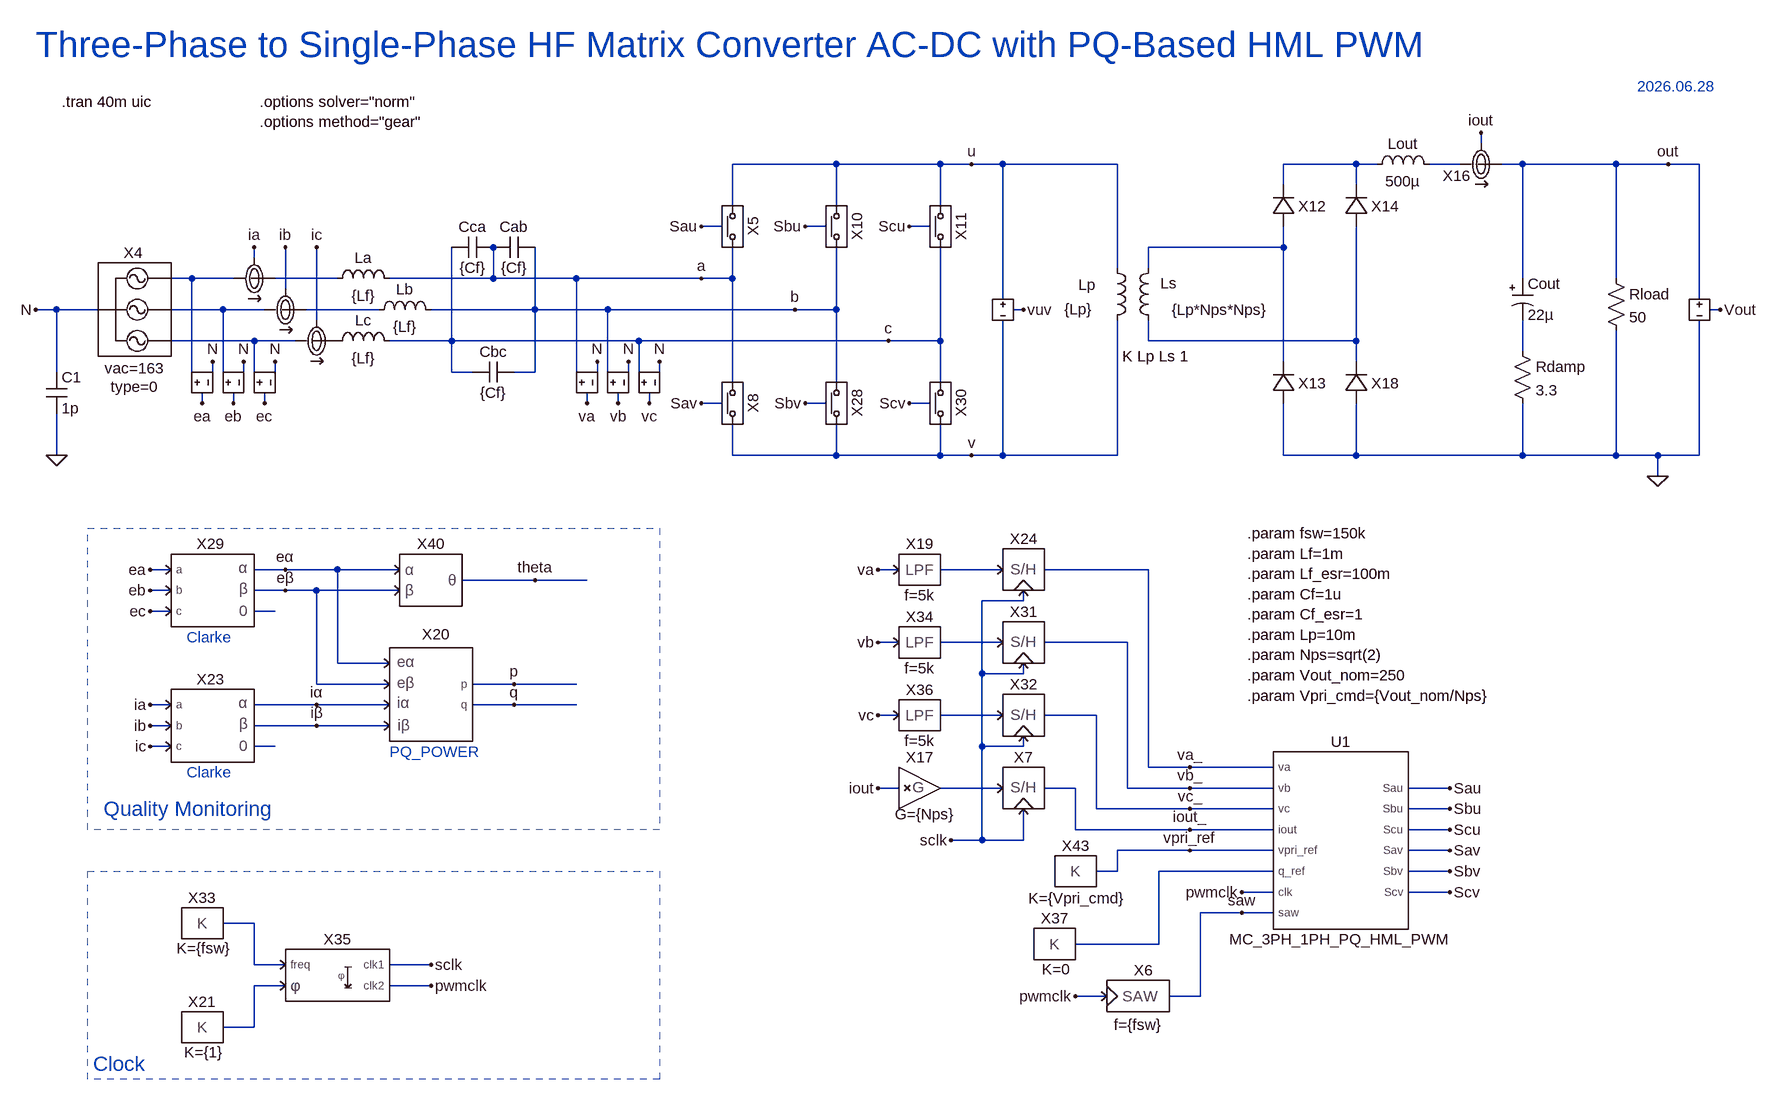
[diagram p0: schematic 3Ph-1Ph-HF-MC-ACDC.asc]
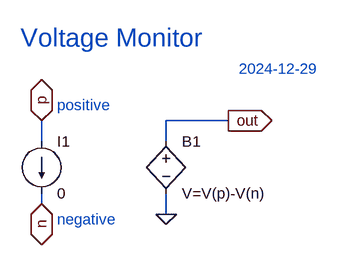
[diagram p1: sub-circuit vmon.asc]
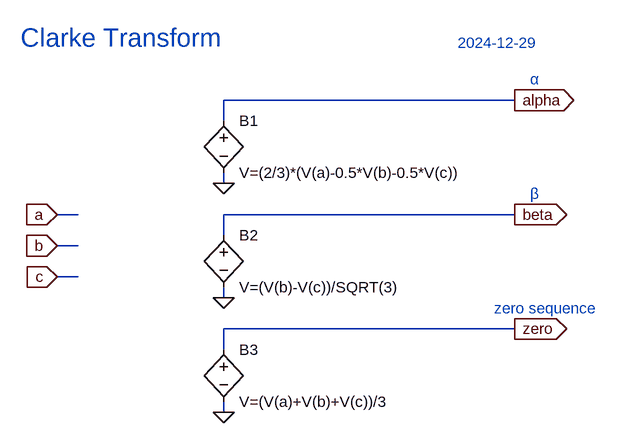
[diagram p2: sub-circuit clarke.asc]
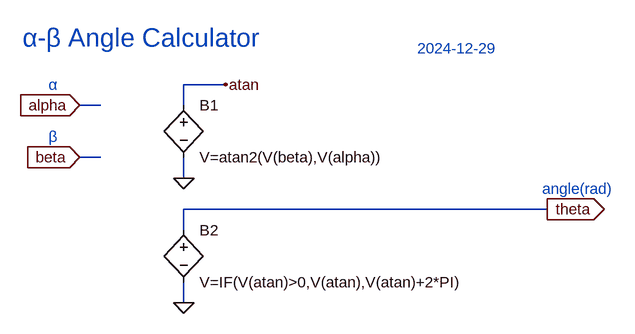
[diagram p3: sub-circuit angle.asc]
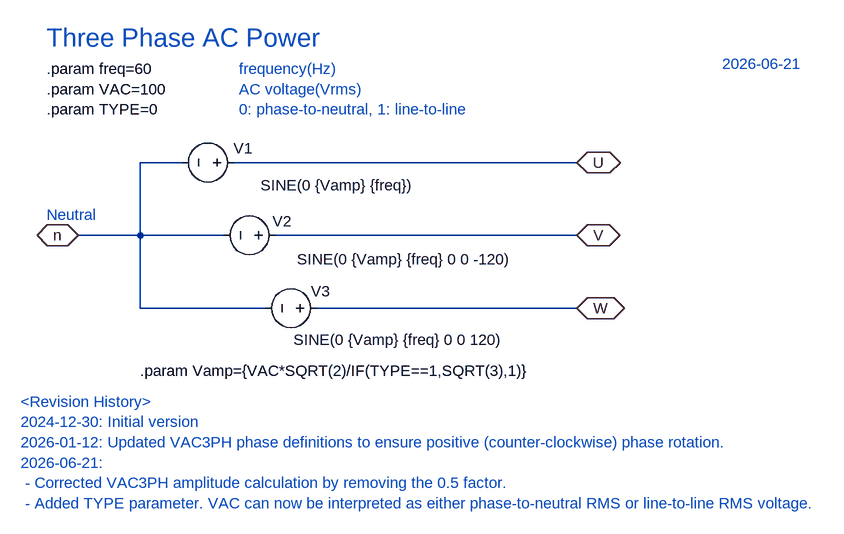
[diagram p4: sub-circuit vac3ph.asc]
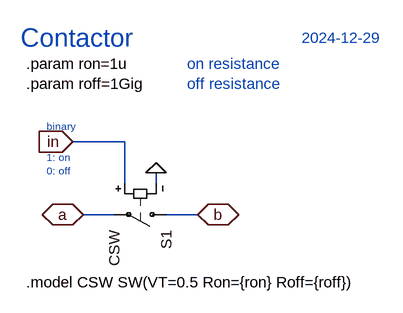
[diagram p5: sub-circuit contactor.asc]
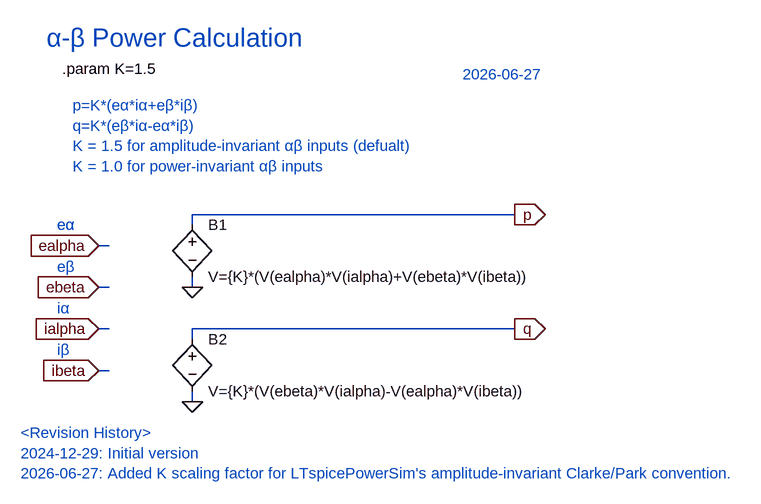
[diagram p6: sub-circuit pq_power.asc]
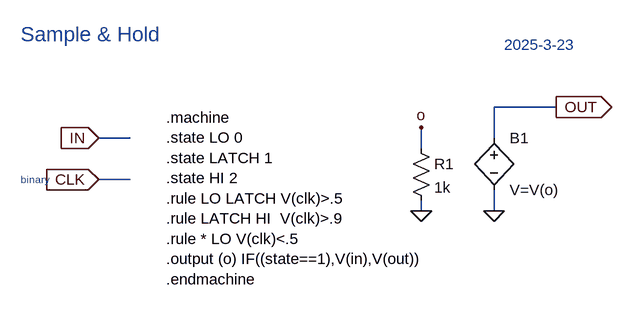
[diagram p7: sub-circuit samplehold.asc]
3Ph-1Ph-HF-MC-ACDC.asc, the LTspice schematic file:
Version 4.1
SHEET 1 2416 2284
WIRE 1360 -240 1360 -256
WIRE 368 -208 208 -208
WIRE 528 -208 368 -208
WIRE 576 -208 528 -208
WIRE 624 -208 576 -208
WIRE 800 -208 624 -208
WIRE 1168 -208 1056 -208
WIRE 1200 -208 1168 -208
WIRE 1328 -208 1280 -208
WIRE 1424 -208 1392 -208
WIRE 1568 -208 1424 -208
WIRE 1648 -208 1568 -208
WIRE 1696 -208 1648 -208
WIRE 1056 -176 1056 -208
WIRE 1168 -176 1168 -208
WIRE 208 -144 208 -208
WIRE 368 -144 368 -208
WIRE 528 -144 528 -208
WIRE 192 -112 160 -112
WIRE 352 -112 320 -112
WIRE 512 -112 480 -112
WIRE 1056 -80 1056 -112
WIRE 1056 -80 848 -80
WIRE -528 -64 -528 -80
WIRE 800 -48 800 -208
WIRE 848 -48 848 -80
WIRE -624 -32 -656 -32
WIRE -560 -32 -624 -32
WIRE -400 -32 -496 -32
WIRE -160 -32 -160 -80
WIRE -160 -32 -320 -32
WIRE -32 -32 -160 -32
WIRE 160 -32 -32 -32
WIRE 208 -32 208 -80
WIRE 208 -32 160 -32
WIRE 1424 -32 1424 -208
WIRE 1568 -32 1568 -208
WIRE -480 -16 -480 -80
WIRE 624 0 624 -208
WIRE 1696 0 1696 -208
WIRE -832 16 -864 16
WIRE -768 16 -832 16
WIRE -576 16 -656 16
WIRE -512 16 -576 16
WIRE -336 16 -448 16
WIRE -96 16 -96 -80
WIRE -96 16 -256 16
WIRE 16 16 -96 16
WIRE 304 16 16 16
WIRE 368 16 368 -80
WIRE 368 16 304 16
WIRE 656 16 640 16
WIRE 1728 16 1712 16
WIRE -432 32 -432 -80
WIRE -528 64 -656 64
WIRE -464 64 -528 64
WIRE -224 64 -224 -80
WIRE -224 64 -320 64
WIRE 64 64 -224 64
WIRE 448 64 64 64
WIRE 528 64 528 -80
WIRE 528 64 448 64
WIRE 848 64 848 32
WIRE 1168 64 1168 -112
WIRE 1168 64 848 64
WIRE 1424 80 1424 32
WIRE 1056 96 1056 -80
WIRE 1168 96 1168 64
WIRE -832 112 -832 16
WIRE -224 112 -224 64
WIRE -192 112 -224 112
WIRE -96 112 -96 16
WIRE -96 112 -128 112
WIRE -624 128 -624 -32
WIRE -592 128 -592 96
WIRE -576 128 -576 16
WIRE -544 128 -544 96
WIRE -528 128 -528 64
WIRE -496 128 -496 96
WIRE -32 128 -32 -32
WIRE 0 128 0 96
WIRE 16 128 16 16
WIRE 48 128 48 96
WIRE 64 128 64 64
WIRE 96 128 96 96
WIRE 208 128 208 -32
WIRE 368 128 368 16
WIRE 528 128 528 64
WIRE -608 160 -608 144
WIRE -560 160 -560 144
WIRE -512 160 -512 144
WIRE -16 160 -16 144
WIRE 32 160 32 144
WIRE 80 160 80 144
WIRE 192 160 160 160
WIRE 352 160 320 160
WIRE 512 160 480 160
WIRE -832 240 -832 176
WIRE 208 240 208 192
WIRE 368 240 368 192
WIRE 368 240 208 240
WIRE 528 240 528 192
WIRE 528 240 368 240
WIRE 576 240 528 240
WIRE 624 240 624 32
WIRE 624 240 576 240
WIRE 800 240 800 32
WIRE 800 240 624 240
WIRE 1056 240 1056 160
WIRE 1168 240 1168 160
WIRE 1168 240 1056 240
WIRE 1424 240 1424 160
WIRE 1424 240 1168 240
WIRE 1568 240 1568 48
WIRE 1568 240 1424 240
WIRE 1632 240 1568 240
WIRE 1696 240 1696 32
WIRE 1696 240 1632 240
WIRE 1632 272 1632 240
WIRE -656 416 -688 416
WIRE -480 416 -528 416
WIRE -400 416 -480 416
WIRE -304 416 -400 416
WIRE 464 416 432 416
WIRE 624 416 528 416
WIRE 848 416 688 416
WIRE -96 432 -208 432
WIRE -16 432 -96 432
WIRE -656 448 -688 448
WIRE -480 448 -528 448
WIRE -432 448 -480 448
WIRE -304 448 -432 448
WIRE 656 464 656 448
WIRE 656 464 592 464
WIRE -656 480 -688 480
WIRE -496 480 -528 480
WIRE 464 528 432 528
WIRE 624 528 528 528
WIRE 816 528 688 528
WIRE -400 560 -400 416
WIRE -320 560 -400 560
WIRE 592 576 592 464
WIRE 656 576 656 560
WIRE 656 576 592 576
WIRE -432 592 -432 448
WIRE -320 592 -432 592
WIRE -128 592 -192 592
WIRE -32 592 -128 592
WIRE -656 624 -688 624
WIRE -432 624 -528 624
WIRE -320 624 -432 624
WIRE -128 624 -192 624
WIRE -32 624 -128 624
WIRE 464 640 432 640
WIRE 624 640 528 640
WIRE 768 640 688 640
WIRE -656 656 -688 656
WIRE -432 656 -528 656
WIRE -320 656 -432 656
WIRE -656 688 -688 688
WIRE -496 688 -528 688
WIRE 592 688 592 576
WIRE 656 688 656 672
WIRE 656 688 592 688
WIRE 848 720 848 416
WIRE 912 720 848 720
WIRE 1040 720 912 720
WIRE 464 752 432 752
WIRE 624 752 528 752
WIRE 736 752 688 752
WIRE 816 752 816 528
WIRE 912 752 816 752
WIRE 1040 752 912 752
WIRE 1312 752 1248 752
WIRE 768 784 768 640
WIRE 912 784 768 784
WIRE 1040 784 912 784
WIRE 1312 784 1248 784
WIRE 736 816 736 752
WIRE 912 816 736 816
WIRE 1040 816 912 816
WIRE 1312 816 1248 816
WIRE 592 832 592 688
WIRE 592 832 544 832
WIRE 656 832 656 784
WIRE 656 832 592 832
WIRE 912 848 800 848
WIRE 1040 848 912 848
WIRE 1312 848 1248 848
WIRE 800 880 800 848
WIRE 800 880 768 880
WIRE 1040 880 864 880
WIRE 1312 880 1248 880
WIRE 1040 912 992 912
WIRE 1312 912 1248 912
WIRE 992 944 928 944
WIRE 1040 944 992 944
WIRE -528 960 -576 960
WIRE 864 992 864 880
WIRE 864 992 736 992
WIRE -528 1024 -528 960
WIRE -480 1024 -528 1024
WIRE -256 1024 -320 1024
WIRE -480 1056 -528 1056
WIRE -256 1056 -320 1056
WIRE 784 1072 736 1072
WIRE 928 1072 928 944
WIRE 928 1072 880 1072
WIRE -528 1120 -528 1056
WIRE -528 1120 -576 1120
FLAG 160 -112 Sau
FLAG 160 160 Sav
FLAG 160 -32 a
FLAG 1648 -208 out
FLAG -528 -80 ia
FLAG 1728 16 Vout
FLAG 1632 272 0
FLAG 1360 -256 iout
FLAG 320 -112 Sbu
FLAG 320 160 Sbv
FLAG 304 16 b
FLAG 480 -112 Scu
FLAG 480 160 Scv
FLAG 448 64 c
FLAG -480 -80 ib
FLAG -864 16 N
FLAG -432 -80 ic
FLAG -688 624 ia
FLAG -688 656 ib
FLAG -688 688 ic
FLAG -432 624 iα
FLAG -432 656 iβ
FLAG -608 160 ea
FLAG -560 160 eb
FLAG -512 160 ec
FLAG -480 416 eα
FLAG -480 448 eβ
FLAG -128 592 p
FLAG -128 624 q
FLAG -592 96 N
FLAG -544 96 N
FLAG -496 96 N
FLAG -96 432 theta
FLAG 576 -208 u
FLAG 576 240 v
FLAG 1312 752 Sau
FLAG 1312 784 Sbu
FLAG 1312 816 Scu
FLAG 1312 848 Sav
FLAG 1312 880 Sbv
FLAG 1312 912 Scv
FLAG -832 240 0
FLAG 656 16 vuv
FLAG 432 416 va
FLAG 432 528 vb
FLAG 432 640 vc
FLAG -256 1024 sclk
FLAG 544 832 sclk
FLAG 736 1072 pwmclk
FLAG 912 720 va_
FLAG 912 752 vb_
FLAG 912 784 vc_
FLAG 992 912 pwmclk
FLAG -256 1056 pwmclk
FLAG 992 944 saw
FLAG 912 848 vpri_ref
FLAG -688 416 ea
FLAG -688 448 eb
FLAG -688 480 ec
FLAG -16 160 va
FLAG 32 160 vb
FLAG 80 160 vc
FLAG 0 96 N
FLAG 48 96 N
FLAG 96 96 N
FLAG 432 752 iout
FLAG 912 816 iout_
SYMBOL polcap 1408 -32 R0
WINDOW 3 24 56 Left 2
SYMATTR Value 22µ
SYMATTR InstName Cout
SYMATTR Description Capacitor
SYMATTR Type cap
SYMATTR SpiceLine Rser=10m
SYMBOL res 1552 -48 R0
SYMATTR InstName Rload
SYMATTR Value 50
SYMBOL IMON -528 -32 M180
WINDOW 0 0 -26 Invisible 2
SYMATTR InstName X1
SYMBOL VMON 1696 16 R0
WINDOW 0 57 -5 Invisible 2
SYMATTR InstName X2
SYMBOL IMON 1360 -208 M180
SYMATTR InstName X16
SYMBOL IMON -480 16 M180
WINDOW 0 0 -26 Invisible 2
SYMATTR InstName X3
SYMBOL IMON -432 64 M180
WINDOW 0 0 -26 Invisible 2
SYMATTR InstName X22
SYMBOL CLARKE -592 656 R0
WINDOW 0 -3 -56 Bottom 2
SYMATTR InstName X23
SYMBOL VMON -608 128 M90
WINDOW 0 57 -5 Invisible 2
SYMATTR InstName X25
SYMBOL VMON -560 128 M90
WINDOW 0 57 -5 Invisible 2
SYMATTR InstName X26
SYMBOL VMON -512 128 M90
WINDOW 0 57 -5 Invisible 2
SYMATTR InstName X27
SYMBOL CLARKE -592 448 R0
WINDOW 0 -3 -56 Bottom 2
SYMATTR InstName X29
SYMBOL PowerSim\\ANGLE -256 432 R0
SYMATTR InstName X40
SYMBOL PowerSim\\VAC3PH -704 16 R0
WINDOW 39 -8 106 Bottom 2
WINDOW 3 -8 134 Bottom 2
SYMATTR SpiceLine vac=163
SYMATTR InstName X4
SYMBOL PowerSim\\CONTACTOR 192 -112 R270
SYMATTR InstName X5
SYMBOL PowerSim\\CONTACTOR 192 160 R270
SYMATTR InstName X8
SYMBOL PowerSim\\CONTACTOR 352 -112 R270
SYMATTR InstName X10
SYMBOL PowerSim\\CONTACTOR 512 -112 R270
SYMATTR InstName X11
SYMBOL PowerSim\\CONTACTOR 352 160 R270
SYMATTR InstName X28
SYMBOL PowerSim\\CONTACTOR 512 160 R270
SYMATTR InstName X30
SYMBOL ind 784 -64 R0
WINDOW 0 -44 42 Left 2
WINDOW 3 -65 79 Left 2
SYMATTR InstName Lp
SYMATTR Value {Lp}
SYMATTR Type ind
SYMATTR SpiceLine Rser=1m
SYMBOL ind 864 -64 M0
WINDOW 0 -28 39 Left 2
WINDOW 3 -167 80 Left 2
SYMATTR InstName Ls
SYMATTR Value {Lp*Nps*Nps}
SYMATTR Type ind
SYMATTR SpiceLine Rser=1m
SYMBOL iD 1056 -144 R180
SYMATTR InstName X12
SYMBOL iD 1056 128 R180
SYMATTR InstName X13
SYMBOL iD 1168 -144 R180
SYMATTR InstName X14
SYMBOL iD 1168 128 R180
SYMATTR InstName X18
SYMBOL ind 1184 -192 R270
WINDOW 0 32 56 VTop 2
WINDOW 3 5 56 VBottom 2
SYMATTR InstName Lout
SYMATTR Value 500µ
SYMATTR SpiceLine Rser=1m
SYMBOL res 1408 64 R0
SYMATTR InstName Rdamp
SYMATTR Value 3.3
SYMBOL cap -848 112 R0
SYMATTR InstName C1
SYMATTR Value 1p
SYMBOL VMON 624 16 R0
WINDOW 0 57 -5 Invisible 2
SYMATTR InstName X15
SYMBOL PowerSim\\PQ_POWER -256 608 R0
WINDOW 0 8 -77 Bottom 2
SYMATTR InstName X20
SYMBOL PowerSim\\SAMPLEHOLD 656 416 R0
SYMATTR InstName X24
SYMBOL PowerSim\\SAMPLEHOLD 656 528 R0
SYMATTR InstName X31
SYMBOL PowerSim\\SAMPLEHOLD 656 640 R0
SYMATTR InstName X32
SYMBOL PowerSim\\SAW 832 1072 R0
WINDOW 3 0 60 Bottom 2
SYMATTR Value f={fsw}
SYMATTR InstName X6
SYMBOL PowerSim\\CONST -608 960 R0
WINDOW 39 2 54 Bottom 2
SYMATTR SpiceLine K={fsw}
SYMATTR InstName X33
SYMBOL PowerSim\\PHASESHIFT2 -400 1040 R0
SYMATTR InstName X35
SYMBOL PowerSim\\CONST -608 1120 R0
WINDOW 39 2 54 Bottom 2
SYMATTR SpiceLine K={1}
SYMATTR InstName X21
SYMBOL PowerSim\\CONST 704 992 R0
WINDOW 39 2 54 Bottom 2
SYMATTR SpiceLine K=0
SYMATTR InstName X37
SYMBOL ind -416 -16 R270
WINDOW 0 32 56 VTop 2
WINDOW 3 5 56 VBottom 2
SYMATTR InstName La
SYMATTR Value {Lf}
SYMATTR SpiceLine Rser={Lf_esr}
SYMBOL ind -352 32 R270
WINDOW 0 32 56 VTop 2
WINDOW 3 5 56 VBottom 2
SYMATTR InstName Lb
SYMATTR Value {Lf}
SYMATTR SpiceLine Rser={Lf_esr}
SYMBOL cap -160 -64 R270
WINDOW 0 32 32 VTop 2
WINDOW 3 0 32 VBottom 2
SYMATTR InstName Cab
SYMATTR Value {Cf}
SYMATTR SpiceLine Rser={Cf_esr}
SYMBOL cap -128 96 R90
WINDOW 0 0 32 VBottom 2
WINDOW 3 32 32 VTop 2
SYMATTR InstName Cbc
SYMATTR Value {Cf}
SYMATTR SpiceLine Rser={Cf_esr}
SYMBOL cap -224 -64 R270
WINDOW 0 32 32 VTop 2
WINDOW 3 0 32 VBottom 2
SYMATTR InstName Cca
SYMATTR Value {Cf}
SYMATTR SpiceLine Rser={Cf_esr}
SYMBOL VMON -16 128 M90
WINDOW 0 57 -5 Invisible 2
SYMATTR InstName X38
SYMBOL VMON 32 128 M90
WINDOW 0 57 -5 Invisible 2
SYMATTR InstName X39
SYMBOL VMON 80 128 M90
WINDOW 0 57 -5 Invisible 2
SYMATTR InstName X41
SYMBOL ind -416 80 R270
WINDOW 0 32 56 VTop 2
WINDOW 3 5 56 VBottom 2
SYMATTR InstName Lc
SYMATTR Value {Lf}
SYMATTR SpiceLine Rser={Lf_esr}
SYMBOL MC_3PH_1PH_PQ_HML_PWM 1136 816 R0
SYMATTR InstName U1
SYMBOL PowerSim\\SAMPLEHOLD 656 752 R0
SYMATTR InstName X7
SYMBOL PowerSim\\GAIN 496 752 R0
WINDOW 39 8 56 Bottom 2
SYMATTR SpiceLine G={Nps}
SYMATTR InstName X17
SYMBOL PowerSim\\LPF 496 416 R0
WINDOW 3 0 55 Bottom 2
SYMATTR Value f=5k
SYMATTR InstName X19
SYMBOL PowerSim\\LPF 496 528 R0
WINDOW 3 0 55 Bottom 2
SYMATTR Value f=5k
SYMATTR InstName X34
SYMBOL PowerSim\\LPF 496 640 R0
WINDOW 3 0 55 Bottom 2
SYMATTR Value f=5k
SYMATTR InstName X36
SYMBOL PowerSim\\CONST 736 880 R0
WINDOW 39 2 57 Bottom 2
SYMATTR SpiceLine K={Vpri_cmd}
SYMATTR InstName X43
TEXT -864 -392 Left 5 ;Three-Phase to Single-Phase HF Matrix Converter AC-DC with PQ-Based HML PWM
TEXT -824 -304 Left 2 !.tran 40m uic
TEXT 1600 -328 Left 2 ;2026.06.28
TEXT -520 -304 Left 2 !.options solver="norm"\n.options method="gear"
TEXT 808 88 Left 2 !K Lp Ls 1
TEXT -320 696 Left 2 ;PQ_POWER
TEXT -632 520 Left 2 ;Clarke
TEXT -632 728 Left 2 ;Clarke
TEXT 1000 360 Left 2 !.param fsw=150k\n.param Lf=1m\n.param Lf_esr=100m\n.param Cf=1u\n.param Cf_esr=1\n.param Lp=10m\n.param Nps=sqrt(2)\n.param Vout_nom=250\n.param Vpri_cmd={Vout_nom/Nps}
TEXT -760 784 Left 3 ;Quality Monitoring
TEXT -776 1176 Left 3 ;Clock
RECTANGLE Normal 96 816 -784 352 2
RECTANGLE Normal 96 1200 -784 880 2

vmon.asc, the sub-circuit schematic file:
Version 4
SHEET 1 880 680
WIRE 176 -32 80 -32
WIRE -112 0 -112 -32
WIRE 80 0 80 -32
WIRE -112 96 -112 80
WIRE 80 112 80 80
FLAG -112 -32 p
IOPIN -112 -32 BiDir
FLAG -112 96 n
IOPIN -112 96 BiDir
FLAG 176 -32 out
IOPIN 176 -32 Out
FLAG 80 112 0
SYMBOL bv 80 -16 R0
SYMATTR InstName B1
SYMATTR Value V=V(p)-V(n)
SYMBOL current -112 0 R0
WINDOW 123 0 0 Left 0
WINDOW 39 0 0 Left 0
SYMATTR InstName I1
SYMATTR Value 0
TEXT -144 -160 Left 4 ;Voltage Monitor
TEXT -88 -56 Left 2 ;positive
TEXT -88 120 Left 2 ;negative
TEXT 192 -112 Left 2 ;2024-12-29

clarke.asc, the sub-circuit schematic file:
Version 4
SHEET 1 880 680
WIRE 464 96 16 96
WIRE 16 128 16 96
WIRE 16 224 16 208
WIRE -208 272 -240 272
WIRE 464 272 16 272
WIRE 16 304 16 272
WIRE -208 320 -240 320
WIRE -208 368 -240 368
WIRE 16 400 16 384
WIRE 464 448 16 448
WIRE 16 480 16 448
WIRE 16 576 16 560
FLAG 16 224 0
FLAG 464 96 alpha
IOPIN 464 96 Out
FLAG -240 272 a
IOPIN -240 272 In
FLAG -240 320 b
IOPIN -240 320 In
FLAG -240 368 c
IOPIN -240 368 In
FLAG 16 400 0
FLAG 464 272 beta
IOPIN 464 272 Out
FLAG 16 576 0
FLAG 464 448 zero
IOPIN 464 448 Out
SYMBOL bv 16 112 R0
SYMATTR InstName B1
SYMATTR Value V=(2/3)*(V(a)-0.5*V(b)-0.5*V(c))
SYMBOL bv 16 288 R0
SYMATTR InstName B2
SYMATTR Value V=(V(b)-V(c))/SQRT(3)
SYMBOL bv 16 464 R0
SYMATTR InstName B3
SYMATTR Value V=(V(a)+V(b)+V(c))/3
TEXT -296 0 Left 4 ;Clarke Transform
TEXT 432 416 Left 2 ;zero sequence
TEXT 488 64 Left 2 ;α
TEXT 488 240 Left 2 ;β
TEXT 376 8 Left 2 ;2024-12-29

angle.asc, the sub-circuit schematic file:
Version 4
SHEET 1 880 680
WIRE -176 48 -240 48
WIRE -368 80 -400 80
WIRE -240 80 -240 48
WIRE -368 160 -400 160
WIRE -240 192 -240 160
WIRE 320 240 -240 240
WIRE -240 272 -240 240
WIRE -240 384 -240 352
FLAG -240 192 0
FLAG -176 48 atan
FLAG -240 384 0
FLAG 320 240 theta
IOPIN 320 240 Out
FLAG -400 80 alpha
IOPIN -400 80 In
FLAG -400 160 beta
IOPIN -400 160 In
SYMBOL bv -240 64 R0
SYMATTR InstName B1
SYMATTR Value V=atan2(V(beta),V(alpha))
SYMBOL bv -240 256 R0
SYMATTR InstName B2
SYMATTR Value V=IF(V(atan)>0,V(atan),V(atan)+2*PI)
TEXT -448 48 Left 2 ;α
TEXT -448 128 Left 2 ;β
TEXT -488 -24 Left 4 ;α-β Angle Calculator
TEXT 312 208 Left 2 ;angle(rad)
TEXT 120 -8 Left 2 ;2024-12-29

vac3ph.asc, the sub-circuit schematic file:
Version 4.1
SHEET 1 1264 876
WIRE 128 112 64 112
WIRE 736 112 208 112
WIRE 64 224 64 112
WIRE 64 224 -32 224
WIRE 192 224 64 224
WIRE 736 224 272 224
WIRE 64 336 64 224
WIRE 256 336 64 336
WIRE 736 336 336 336
FLAG 736 112 U
IOPIN 736 112 BiDir
FLAG -32 224 n
IOPIN -32 224 BiDir
FLAG 736 336 W
IOPIN 736 336 BiDir
FLAG 736 224 V
IOPIN 736 224 BiDir
SYMBOL voltage 224 112 R90
WINDOW 3 35 -262 VRight 2
WINDOW 123 0 0 Left 0
WINDOW 39 0 0 Left 0
WINDOW 0 -22 -13 VRight 2
SYMATTR Value SINE(0 {Vamp} {freq})
SYMATTR InstName V1
SYMBOL voltage 288 224 R90
WINDOW 3 37 -350 VRight 2
WINDOW 123 0 0 Left 0
WINDOW 39 0 0 Left 0
WINDOW 0 -22 -9 VRight 2
SYMATTR Value SINE(0 {Vamp} {freq} 0 0 -120)
SYMATTR InstName V2
SYMBOL voltage 352 336 M270
WINDOW 3 -49 52 VLeft 2
WINDOW 123 0 0 Left 0
WINDOW 39 0 0 Left 0
WINDOW 0 26 25 VLeft 2
SYMATTR Value SINE(0 {Vamp} {freq} 0 0 120)
SYMATTR InstName V3
TEXT -80 -32 Left 2 !.param freq=60\n.param VAC=100\n.param TYPE=0
TEXT -80 -80 Left 4 ;Three Phase AC Power
TEXT -80 192 Left 2 ;Neutral
TEXT 64 432 Left 2 !.param Vamp={VAC*SQRT(2)/IF(TYPE==1,SQRT(3),1)}
TEXT 216 -32 Left 2 ;frequency(Hz)\nAC voltage(Vrms)\n0: phase-to-neutral, 1: line-to-line
TEXT 960 -40 Left 2 ;2026-06-21
TEXT -120 480 Left 2 ;<Revision History>\n2024-12-30: Initial version\n2026-01-12: Updated VAC3PH phase definitions to ensure positive (counter-clockwise) phase rotation.\n2026-06-21: \n - Corrected VAC3PH amplitude calculation by removing the 0.5 factor. \n - Added TYPE parameter. VAC can now be interpreted as either phase-to-neutral RMS or line-to-line RMS voltage.

contactor.asc, the sub-circuit schematic file:
Version 4
SHEET 1 1504 680
WIRE 416 128 336 128
WIRE 416 192 416 128
WIRE 464 192 464 176
WIRE 400 240 352 240
WIRE 528 240 480 240
FLAG 352 240 a
IOPIN 352 240 BiDir
FLAG 528 240 b
IOPIN 528 240 BiDir
FLAG 336 128 in
IOPIN 336 128 In
FLAG 464 176 0
SYMBOL sw 496 240 R90
SYMATTR InstName S1
SYMATTR Value CSW
SYMATTR Prefix SW
TEXT 264 8 Left 2 !.param ron=1u\n.param roff=1Gig
TEXT 264 344 Left 2 !.model CSW SW(VT=0.5 Ron={ron} Roff={roff})
TEXT 256 -32 Left 4 ;Contactor
TEXT 512 8 Left 2 ;on resistance\noff resistance
TEXT 296 104 Left 1 ;binary
TEXT 296 152 Left 1 ;1: on\n0: off
TEXT 688 -32 Left 2 ;2024-12-29

pq_power.asc, the sub-circuit schematic file:
Version 4.1
SHEET 1 1432 680
WIRE 592 208 96 208
WIRE 96 224 96 208
WIRE -32 256 -48 256
WIRE -32 320 -48 320
WIRE 96 320 96 304
WIRE -32 384 -48 384
WIRE 592 384 96 384
WIRE 96 400 96 384
WIRE -32 448 -48 448
WIRE 96 496 96 480
FLAG -48 256 ealpha
IOPIN -48 256 In
FLAG -48 320 ebeta
IOPIN -48 320 In
FLAG -48 384 ialpha
IOPIN -48 384 In
FLAG -48 448 ibeta
IOPIN -48 448 In
FLAG 96 320 0
FLAG 592 208 p
IOPIN 592 208 Out
FLAG 96 496 0
FLAG 592 384 q
IOPIN 592 384 Out
SYMBOL bv 96 208 R0
SYMATTR InstName B1
SYMATTR Value V={K}*(V(ealpha)*V(ialpha)+V(ebeta)*V(ibeta))
SYMBOL bv 96 384 R0
SYMATTR InstName B2
SYMATTR Value V={K}*(V(ebeta)*V(ialpha)-V(ealpha)*V(ibeta))
TEXT -88 40 Left 2 ;p=K*(eα*iα+eβ*iβ)\nq=K*(eβ*iα-eα*iβ)\nK = 1.5 for amplitude-invariant αβ inputs (defualt)\nK = 1.0 for power-invariant αβ inputs
TEXT -128 -64 Left 4 ;α-β Power Calculation
TEXT -112 224 Left 2 ;eα
TEXT -112 224 Left 2 ;eα
TEXT -112 288 Left 2 ;eβ
TEXT -112 352 Left 2 ;iα
TEXT -112 416 Left 2 ;iβ
TEXT 512 -8 Left 2 ;2026-06-27
TEXT -104 -16 Left 2 !.param K=1.5
TEXT -168 544 Left 2 ;<Revision History>\n2024-12-29: Initial version\n2026-06-27: Added K scaling factor for LTspicePowerSim's amplitude-invariant Clarke/Park convention.

samplehold.asc, the sub-circuit schematic file:
Version 4
SHEET 1 880 680
WIRE 576 -560 480 -560
WIRE -80 -512 -128 -512
WIRE 480 -512 480 -560
WIRE 368 -496 368 -528
WIRE -80 -448 -128 -448
WIRE 368 -400 368 -416
WIRE 480 -400 480 -432
FLAG -128 -512 IN
IOPIN -128 -512 In
FLAG -128 -448 CLK
IOPIN -128 -448 In
FLAG 576 -560 OUT
IOPIN 576 -560 Out
FLAG 368 -400 0
FLAG 368 -528 o
FLAG 480 -400 0
SYMBOL res 352 -512 R0
SYMATTR InstName R1
SYMATTR Value 1k
SYMBOL bv 480 -528 R0
SYMATTR InstName B1
SYMATTR Value V=V(o)
TEXT -248 -672 Left 3 ;Sample & Hold
TEXT -248 -448 Left 1 ;binary
TEXT 496 -656 Left 2 ;2025-3-23
TEXT -24 -544 Left 2 !.machine\n.state LO 0\n.state LATCH 1\n.state HI 2\n.rule LO LATCH V(clk)>.5\n.rule LATCH HI  V(clk)>.9\n.rule * LO V(clk)<.5\n.output (o) IF((state==1),V(in),V(out))  \n.endmachine

saw.asc, the sub-circuit schematic file:
Version 4
SHEET 1 1624 680
WIRE 0 -144 -32 -144
WIRE 0 -64 0 -144
WIRE 32 -64 0 -64
WIRE 144 -48 96 -48
WIRE 272 -48 208 -48
WIRE 496 -48 432 -48
WIRE -96 -32 -176 -32
WIRE 32 -32 -32 -32
FLAG -176 -32 clk
IOPIN -176 -32 In
FLAG 496 -48 saw
IOPIN 496 -48 Out
SYMBOL PowerSim\\SLOPE 176 -48 R0
WINDOW 39 -2 51 Bottom 2
WINDOW 40 -6 75 Bottom 2
SYMATTR SpiceLine se={f}
SYMATTR SpiceLine2 vsat=2
SYMATTR InstName X1
SYMBOL PowerSim\\POSEDGE -64 -32 R0
WINDOW 39 3 55 Bottom 2
SYMATTR SpiceLine td={td}
SYMATTR InstName X2
SYMBOL PowerSim\\EXOR 64 -48 R0
SYMATTR InstName X3
SYMBOL PowerSim\\CONST -64 -144 R0
WINDOW 39 1 51 Bottom 2
SYMATTR InstName X4
SYMBOL PowerSim\\LIMIT 352 -48 R0
WINDOW 39 26 71 Bottom 2
SYMATTR SpiceLine max={vh} min=0
SYMATTR InstName X5
TEXT -256 -408 Left 4 ;SAW Generator
TEXT 584 -432 Left 2 ;2025-3-22
TEXT -240 -360 Left 2 !.param f=1Meg\n.param td=10n
TEXT 0 -360 Left 2 ;frequency of the input clock\ndelay from clk posedge to start of the slope
TEXT 480 -224 Right 1 ;1
TEXT 608 -192 Left 1 ;0
TEXT 312 40 Left 2 !.param vh=1
TEXT 496 -184 Right 1 ;td
LINE Normal 528 -224 497 -192
LINE Normal 496 -176 496 -240 2
LINE Normal 576 -160 576 -160 2
LINE Normal 496 -240 480 -240
LINE Normal 496 -240 496 -272
LINE Normal 512 -272 496 -272
LINE Normal 512 -240 512 -272
LINE Normal 528 -240 512 -240
LINE Normal 528 -240 528 -272
LINE Normal 544 -272 528 -272
LINE Normal 544 -240 544 -272
LINE Normal 560 -240 544 -240
LINE Normal 560 -240 560 -272
LINE Normal 576 -272 560 -272
LINE Normal 576 -240 576 -272
LINE Normal 528 -176 528 -240 2
LINE Normal 560 -176 560 -240 2
LINE Normal 560 -224 529 -192
LINE Normal 496 -192 496 -224
LINE Normal 496 -224 465 -192
LINE Normal 497 -192 496 -192
LINE Normal 528 -192 528 -224
LINE Normal 529 -192 528 -192
LINE Normal 592 -224 561 -192
LINE Normal 560 -192 560 -224
LINE Normal 561 -192 560 -192
LINE Normal 480 -224 544 -224 2
LINE Normal 544 -192 608 -192 2
LINE Normal 494 -251 496 -256
LINE Normal 498 -251 496 -256
LINE Normal 526 -251 528 -256
LINE Normal 530 -251 528 -256
LINE Normal 558 -251 560 -256
LINE Normal 562 -251 560 -256
CIRCLE Normal 512 -192 496 -192 2
CIRCLE Normal 492 -198 502 -188 2

slope.asc, the sub-circuit schematic file:
Version 4.1
SHEET 1 2080 1228
WIRE -64 288 -64 256
WIRE 1200 288 1120 288
WIRE 768 336 768 288
WIRE 928 336 928 288
WIRE 1120 336 1120 288
WIRE -64 400 -64 368
WIRE -64 400 -96 400
WIRE 128 400 -64 400
WIRE -64 432 -64 400
WIRE 768 448 768 416
WIRE 928 448 928 416
WIRE 1120 448 1120 416
WIRE -64 528 -64 496
WIRE 1200 592 848 592
WIRE 848 608 848 592
WIRE 1200 608 1200 592
WIRE 128 656 -304 656
WIRE 848 704 848 688
WIRE 1200 704 1200 688
FLAG -304 656 in
IOPIN -304 656 In
FLAG -64 256 0
FLAG -64 528 0
FLAG 1200 288 out
IOPIN 1200 288 Out
FLAG -96 400 a
FLAG 1120 448 0
FLAG 768 448 0
FLAG 768 288 o
FLAG 928 448 0
FLAG 928 288 b
FLAG 1200 704 0
FLAG 848 704 0
SYMBOL current -64 288 R0
SYMATTR InstName I1
SYMATTR Value {ibias}
SYMBOL cap -80 432 R0
SYMATTR InstName C3
SYMATTR Value {cacc}
SYMBOL bv 1120 320 R0
SYMATTR InstName B1
SYMATTR Value V=IF(V(in)>0.5, se*(V(a)-V(b)), 0)
SYMBOL res 752 320 R0
SYMATTR InstName R1
SYMATTR Value 1k
SYMBOL bv 928 320 R0
SYMATTR InstName B2
SYMATTR Value V=V(o)
SYMBOL bv 848 592 R0
SYMATTR InstName B3
SYMATTR Value V=IF(V(in)>0.5,1, 0)
SYMBOL res 1184 592 R0
SYMATTR InstName R2
SYMATTR Value 1k
TEXT -304 112 Left 2 !.param se=1
TEXT -304 24 Left 4 ;Slope
TEXT -352 632 Left 1 ;binary
TEXT -136 112 Left 2 ;dv/dt of the slope(V/sec)
TEXT 248 136 Left 1 ;in
TEXT 240 72 Left 1 ;out
TEXT 376 80 Right 1 ;dv/dt=se
TEXT 1192 48 Left 2 ;2026-03-18
TEXT -304 768 Left 2 ;<Revision History>\n2024-12-29: Initial Versoin\n2025-02-23: Made following edit to remove negative spike at slope reset and improve simulation time.\n                    - scale of I1 & C2 by 1/1000, and reduced resistance of diode Ron and buffer Rout\n                    - changed C1 snubber parameter, \n                    - added D2 to clamp negative voltage at node a \n                    - added new parameter vsat to be able to specify saturating voltage\n2025-04-12: Bug fix \n                    - Fixed a bug where the model would not work when vsat was set to a high voltage \n                    - Changed default vsat to 1000V (originally 1V).\n2025-05-31: Solved convergence issue at high "se" \n                    - Replaced current source with state machine.\n2026-01-02: Changed to .machine base for higher accuracy and convergence.\n                    - removed .param vsat\n2026-03-18: Updated .machine statement syntax to support older version of the LTspice.
TEXT -304 144 Left 2 ;.param vsat=1000 (removed)
TEXT -312 472 Left 2 !.param cacc=1u\n.param ibias=1u
TEXT -312 440 Left 2 !.ic V(a)=0
TEXT 232 368 Left 2 !.machine\n.state LO 0\n.state HI 1\n.rule LO HI V(in)>.5\n.rule HI LO V(in)<.5\n.output (o) IF((state==1),V(b), V(a))\n.endmachine
TEXT 768 560 Left 2 ;dummy circuit to ensure stiff falling edge
LINE Normal 288 144 240 144
LINE Normal 288 144 288 112
LINE Normal 384 112 288 112
LINE Normal 384 144 384 112
LINE Normal 432 144 384 144
LINE Normal 288 80 240 80
LINE Normal 288 80 384 32
LINE Normal 384 80 384 32
LINE Normal 432 80 384 80
LINE Normal 288 112 288 80 1
LINE Normal 384 112 384 80 1
RECTANGLE Normal 448 160 225 18 2
RECTANGLE Normal 1296 736 736 576 2

posedge.asc, the sub-circuit schematic file:
Version 4
SHEET 1 880 680
WIRE 192 160 128 160
WIRE 448 160 192 160
WIRE 624 160 512 160
WIRE 192 192 192 160
WIRE 272 192 192 192
WIRE 448 192 336 192
WIRE 272 224 272 208
WIRE 464 224 464 208
FLAG 128 160 in
IOPIN 128 160 In
FLAG 464 224 0
FLAG 624 160 out
IOPIN 624 160 Out
FLAG 272 224 0
SYMBOL Digital\\and 480 112 R0
WINDOW 0 -36 12 Left 2
SYMATTR InstName A2
SYMBOL Digital\\inv 272 128 R0
WINDOW 3 21 88 Left 2
WINDOW 0 -38 78 Left 2
SYMATTR Value TD={td}
SYMATTR InstName A1
TEXT 88 64 Left 2 !.param td=10n
TEXT 80 16 Left 4 ;Positive Edge Detector
TEXT 88 136 Left 1 ;binary
TEXT 624 136 Left 1 ;binary
TEXT 544 104 Left 1 ;td
TEXT 304 64 Left 2 ;pulse width
TEXT 584 56 Left 2 ;2024-12-29
LINE Normal 544 144 528 144
LINE Normal 544 144 544 112
LINE Normal 560 144 560 112
LINE Normal 576 144 560 144
LINE Normal 544 112 560 112

exor.asc, the sub-circuit schematic file:
Version 4
SHEET 1 880 680
WIRE 160 128 32 128
WIRE 368 128 224 128
WIRE 160 160 32 160
WIRE 192 192 192 176
FLAG 192 192 0
FLAG 32 128 in1
IOPIN 32 128 In
FLAG 32 160 in2
IOPIN 32 160 In
FLAG 368 128 out
IOPIN 368 128 Out
SYMBOL Digital\\xor 208 80 R0
WINDOW 0 -28 14 Left 2
SYMATTR InstName A1
TEXT -24 104 Left 1 ;binary
TEXT -24 184 Left 1 ;binary
TEXT 368 104 Left 1 ;binary
TEXT -32 40 Left 4 ;Exclusive OR
TEXT 280 48 Left 2 ;2024-12-29

phaseshift2.asc, the sub-circuit schematic file:
Version 4
SHEET 1 1572 1312
WIRE -128 -112 -224 -112
WIRE -224 -80 -224 -112
WIRE -960 -64 -992 -64
WIRE -128 -32 -128 -112
WIRE -224 32 -224 0
WIRE -128 128 -128 48
WIRE -80 128 -128 128
WIRE 16 128 -80 128
WIRE 96 128 16 128
WIRE 256 128 256 112
WIRE 336 128 256 128
WIRE 16 144 16 128
WIRE 256 144 256 128
WIRE 480 144 400 144
WIRE 336 176 336 160
WIRE -944 192 -976 192
WIRE -128 208 -128 128
WIRE 16 240 16 208
WIRE 256 256 256 224
WIRE -128 320 -128 288
WIRE -928 496 -928 480
WIRE -928 592 -928 576
WIRE 480 624 400 624
WIRE 256 640 256 624
WIRE 336 640 256 640
WIRE 256 656 256 640
WIRE -928 688 -928 672
WIRE 336 688 336 672
WIRE 256 768 256 736
WIRE -928 784 -928 768
FLAG -992 -64 freq
IOPIN -992 -64 In
FLAG 16 240 0
FLAG -224 32 0
FLAG -976 192 phase
IOPIN -976 192 In
FLAG -128 320 0
FLAG 256 256 0
FLAG -80 128 a
FLAG -928 592 0
FLAG -928 480 d
FLAG 480 144 clk1
IOPIN 480 144 Out
FLAG 336 176 0
FLAG 256 112 b
FLAG 256 768 0
FLAG 480 624 clk2
IOPIN 480 624 Out
FLAG 336 688 0
FLAG 256 624 c
FLAG -928 784 0
FLAG -928 672 ph
SYMBOL cap 0 144 R0
SYMATTR InstName C1
SYMATTR Value 0.5
SYMBOL voltage -224 -96 R0
WINDOW 123 0 0 Left 0
WINDOW 39 0 0 Left 0
SYMATTR InstName V2
SYMATTR Value 2
SYMBOL bi -128 -32 R0
SYMATTR InstName B1
SYMATTR Value I=IF(V(b),0,V(freq))
SYMBOL bi -128 208 R0
SYMATTR InstName B2
SYMATTR Value I=IF(V(b),V(freq),0)
SYMBOL res 240 128 R0
SYMATTR InstName R2
SYMATTR Value 1k
SYMBOL bv -928 480 R0
SYMATTR InstName B3
SYMATTR Value V=IF(V(phase)>180,180,V(phase))
SYMBOL Digital\\buf 336 64 R0
SYMATTR InstName A1
SYMBOL res 240 640 R0
SYMATTR InstName R1
SYMATTR Value 1k
SYMBOL Digital\\buf 336 576 R0
SYMATTR InstName A3
SYMBOL bv -928 672 R0
SYMATTR InstName B4
SYMATTR Value V=IF(V(d)<-180,-180,V(d))/180+1n
TEXT -520 32 Left 2 !.machine\n.state LO 0\n.state HI 1\n.rule LO HI V(a)>(1+1n)\n.rule HI LO V(a)<1n\n.output (b) state\n.endmachine
TEXT 24 96 Left 2 !.ic V(a)=0
TEXT -320 448 Left 2 !.machine\n.state LO0a 0\n.state LO0b 0\n.state LO1a 0\n.state LO1b 0\n.state HI0a 1\n.state HI0b 1\n.state HI1a 1\n.state HI1b 1\n.rule LO0a LO1a V(ph)>=0\n.rule LO1a LO0a V(ph)<0\n.rule LO1a LO1b V(a)<1n\n.rule LO1b HI1a V(a)>V(ph)\n.rule HI1a HI1b V(a)>1+1n\n.rule HI1b LO1a V(a)<(1-V(ph))\n.rule LO0a LO0b V(a)>1+1n\n.rule LO0b HI0a V(a)<abs(V(ph))\n.rule HI0a HI0b V(a)<1n\n.rule HI0b LO0a V(a)>(1-abs(V(ph)))\n.output (c) state\n.endmachine
TEXT 232 440 Left 2 !.ic V(clk1)=0 V(clk2)=0
TEXT -1072 -208 Left 4 ;Frequency Variable Phase Modulator
TEXT -1064 -104 Left 2 ;Frequency(Hz)
TEXT -1064 152 Left 2 ;Phase(°)
TEXT -104 -184 Left 2 ;2024-12-29

gain.asc, the sub-circuit schematic file:
Version 4
SHEET 1 880 680
WIRE 0 64 -48 64
WIRE 240 64 144 64
WIRE 144 96 144 64
WIRE 144 192 144 176
FLAG 144 192 0
FLAG 240 64 out
IOPIN 240 64 Out
FLAG -48 64 in
IOPIN -48 64 In
SYMBOL bv 144 80 R0
WINDOW 3 23 92 Left 2
SYMATTR Value V={G}*V(in)
SYMATTR InstName B1
TEXT -88 8 Left 2 !.param G=1
TEXT -88 -40 Left 4 ;GAIN
TEXT 144 -32 Left 2 ;2024-12-29

lpf.asc, the sub-circuit schematic file:
Version 4.1
SHEET 1 1652 804
WIRE 944 -80 848 -80
WIRE 192 -48 80 -48
WIRE 304 -48 272 -48
WIRE 384 -48 304 -48
WIRE 688 -48 464 -48
WIRE 80 -32 80 -48
WIRE 304 -32 304 -48
WIRE 464 -32 464 -48
WIRE 848 -16 848 -80
WIRE -96 0 -160 0
WIRE 304 48 304 32
WIRE 464 64 464 48
WIRE 80 80 80 48
WIRE 848 112 848 64
WIRE 192 288 192 256
WIRE 192 288 128 288
WIRE 256 288 192 288
WIRE 496 288 496 256
WIRE 496 288 432 288
WIRE 560 288 496 288
WIRE 192 320 192 288
WIRE 256 320 256 288
WIRE 432 320 432 288
WIRE 496 320 496 288
WIRE 560 320 560 288
WIRE 128 336 128 288
WIRE 128 480 128 416
WIRE 192 480 192 384
WIRE 256 480 256 400
WIRE 432 480 432 400
WIRE 496 480 496 384
WIRE 560 480 560 400
FLAG -160 0 in
IOPIN -160 0 In
FLAG 944 -80 out
IOPIN 944 -80 Out
FLAG 304 48 0
FLAG 80 80 0
FLAG 384 -48 a
FLAG 464 64 0
FLAG 848 112 0
FLAG 256 480 0
FLAG 192 256 v1
FLAG 496 256 v2
FLAG 128 480 0
FLAG 560 480 0
FLAG 688 -48 v0
FLAG 192 480 0
FLAG 496 480 0
FLAG 432 480 0
SYMBOL res 288 -64 R90
WINDOW 0 0 56 VBottom 2
WINDOW 3 32 56 VTop 2
SYMATTR InstName R1
SYMATTR Value 1k
SYMBOL cap 288 -32 R0
SYMATTR InstName C1
SYMATTR Value {Co}
SYMBOL bv 80 -48 R0
SYMATTR InstName B1
SYMATTR Value V=V(in)
SYMBOL bv 464 -48 R0
SYMATTR InstName B2
SYMATTR Value V=V(a)
SYMBOL bv 848 -32 R0
SYMATTR InstName B3
SYMATTR Value V=IF({n}==1,V(v0),V(v1))
SYMBOL res 240 304 R0
SYMATTR InstName R2
SYMATTR Value 1Gig
SYMBOL cap 176 320 R0
SYMATTR InstName C2
SYMATTR Value 1
SYMBOL bi 128 416 R180
WINDOW 0 24 80 Left 2
WINDOW 3 24 0 Left 2
SYMATTR InstName B5
SYMATTR Value I=V(v2)
SYMBOL res 448 304 M0
SYMATTR InstName R3
SYMATTR Value 1Gig
SYMBOL cap 512 320 M0
SYMATTR InstName C3
SYMATTR Value 1
SYMBOL bi 560 400 R180
WINDOW 3 -848 -5 Left 2
WINDOW 0 -56 82 Left 2
SYMATTR Value I={-(2*pi*f)*(2*pi*f)*V(v1)-(2*pi*f/q)*V(v2)+(2*pi*f)*(2*pi*f)*V(in)}
SYMATTR InstName B4
TEXT -264 -368 Left 4 ;1st/2nd order Low Pass Filter
TEXT 696 -368 Left 2 ;2025-12-26
TEXT -256 -304 Left 2 !.param f=100k\n.param n=1\n.param q=0.5
TEXT 328 -80 Left 2 !.param Co=1/({f}*2k*PI)
TEXT 0 -304 Left 2 ;cut off frequency\nfilter order (1:1st order, other: 2nd order)\nq factor (only for 2nd order)
TEXT -8 -112 Left 2 ;1st Order LPF
TEXT 8 160 Left 2 ;2nd Order LPF
TEXT -152 560 Left 2 ;<Revision History>\n2025-03-23: Initial version\n2025-12-26: \n -  Replaced LTspice built in 2ndOrderLPF with discrete circuit to improve convergence.\n -  Removed output MUX and replaced it with BV.
RECTANGLE Normal 752 112 -16 -96 2
RECTANGLE Normal 1440 512 -16 192 2

The netlist it stands for:
* 3Ph-1Ph-HF-MC-ACDC.asc
Cout out N010 22µ Rser=10m
Rload out 0 50
X§X1 N005 ia N004 IMON rsns=10u  ; pins n out p
X§X2 0 Vout out vmon
X§X16 out iout N002 IMON rsns=10u  ; pins n out p
X§X3 N007 ib N006 IMON rsns=10u  ; pins n out p
X§X22 P001 ic N008 IMON rsns=10u  ; pins n out p
X§X23 ia ib ic iα iβ N015 clarke
X§X25 N ea N004 vmon
X§X26 N eb N006 vmon
X§X27 N ec N008 vmon
X§X29 ea eb ec eα eβ N012 clarke
X§X40 eα eβ theta angle
X§X4 N N004 N006 N008 vac3ph params: type=0 vac=163 freq=60
X§X5 Sau a u contactor params: ron=1u roff=1Gig
X§X8 Sav v a contactor params: ron=1u roff=1Gig
X§X10 Sbu b u contactor params: ron=1u roff=1Gig
X§X11 Scu c u contactor params: ron=1u roff=1Gig
X§X28 Sbv v b contactor params: ron=1u roff=1Gig
X§X30 Scv v c contactor params: ron=1u roff=1Gig
Lp u v {Lp} Rser=1m
Ls N003 N009 {Lp*Nps*Nps} Rser=1m
X§X12 N003 N001 iD params: von=1n ron=10m esl=1f rsnb=1k csnb=10p  ; pins AN CA
X§X13 0 N003 iD params: von=1n ron=10m esl=1f rsnb=1k csnb=10p  ; pins AN CA
X§X14 N009 N001 iD params: von=1n ron=10m esl=1f rsnb=1k csnb=10p  ; pins AN CA
X§X18 0 N009 iD params: von=1n ron=10m esl=1f rsnb=1k csnb=10p  ; pins AN CA
Lout N001 N002 500µ Rser=1m
Rdamp N010 0 3.3
C1 N 0 1p
X§X15 v vuv u vmon
X§X20 eα eβ iα iβ p q pq_power params: K=1.5
X§X24 sclk N011 va_ samplehold
X§X31 sclk N013 vb_ samplehold
X§X32 sclk N014 vc_ samplehold
X§X6 pwmclk saw saw params: f={fsw} td=10n
X§X33 N018 CONST K={fsw}  ; pins K
X§X35 N018 N019 sclk pwmclk phaseshift2
X§X21 N019 CONST K={1}  ; pins K
X§X37 N017 CONST K=0  ; pins K
La N005 a {Lf} Rser={Lf_esr}
Lb N007 b {Lf} Rser={Lf_esr}
Cab a b {Cf} Rser={Cf_esr}
Cbc b c {Cf} Rser={Cf_esr}
Cca c a {Cf} Rser={Cf_esr}
X§X38 N va a vmon
X§X39 N vb b vmon
X§X41 N vc c vmon
Lc P001 c {Lf} Rser={Lf_esr}
X§U1 va_ vb_ vc_ iout_ vpri_ref N017 pwmclk saw Sau Sbu Scu Sav Sbv Scv MC_3PH_1PH_PQ_HML_PWM  ; pins va vb vc iout vpri_ref q_ref clk saw Sau Sbu Scu Sav Sbv Scv
X§X7 sclk N016 iout_ samplehold
X§X17 iout N016 gain params: G={Nps}
X§X19 va N011 lpf params: f=5k n=1 q=0.5
X§X34 vb N013 lpf params: f=5k n=1 q=0.5
X§X36 vc N014 lpf params: f=5k n=1 q=0.5
X§X43 vpri_ref CONST K={Vpri_cmd}  ; pins K

* block symbol definitions
.subckt vmon n out p
B1 out 0 V=V(p)-V(n)
I1 p n 0
* Voltage Monitor
* positive
* negative
* 2024-12-29
.ends vmon

.subckt clarke a b c alpha beta zero
B1 alpha 0 V=(2/3)*(V(a)-0.5*V(b)-0.5*V(c))
B2 beta 0 V=(V(b)-V(c))/SQRT(3)
B3 zero 0 V=(V(a)+V(b)+V(c))/3
* Clarke Transform
* zero sequence
* α
* β
* 2024-12-29
.ends clarke

.subckt angle alpha beta theta
B1 atan 0 V=atan2(V(beta),V(alpha))
B2 theta 0 V=IF(V(atan)>0,V(atan),V(atan)+2*PI)
* α
* β
* α-β Angle Calculator
* angle(rad)
* 2024-12-29
.ends angle

.subckt vac3ph n U V W
V1 U n SINE(0 {Vamp} {freq})
V2 V n SINE(0 {Vamp} {freq} 0 0 -120)
V3 W n SINE(0 {Vamp} {freq} 0 0 120)
.param freq=60
.param VAC=100
.param TYPE=0
* Three Phase AC Power
* Neutral
.param Vamp={VAC*SQRT(2)/IF(TYPE==1,SQRT(3),1)}
* frequency(Hz)
* AC voltage(Vrms)
* 0: phase-to-neutral, 1: line-to-line
* 2026-06-21
* <Revision History>
* 2024-12-30: Initial version
* 2026-01-12: Updated VAC3PH phase definitions to ensure positive (counter-clockwise) phase rotation.
* 2026-06-21:
*  - Corrected VAC3PH amplitude calculation by removing the 0.5 factor.
*  - Added TYPE parameter. VAC can now be interpreted as either phase-to-neutral RMS or line-to-line RMS voltage.
.ends vac3ph

.subckt contactor in a b
S1 b a in 0 CSW
.param ron=1u
.param roff=1Gig
.model CSW SW(VT=0.5 Ron={ron} Roff={roff})
* Contactor
* on resistance
* off resistance
* binary
* 1: on
* 0: off
* 2024-12-29
.ends contactor

.subckt pq_power ealpha ebeta ialpha ibeta p q
B1 p 0 V={K}*(V(ealpha)*V(ialpha)+V(ebeta)*V(ibeta))
B2 q 0 V={K}*(V(ebeta)*V(ialpha)-V(ealpha)*V(ibeta))
* p=K*(eα*iα+eβ*iβ)
* q=K*(eβ*iα-eα*iβ)
* K = 1.5 for amplitude-invariant αβ inputs (defualt)
* K = 1.0 for power-invariant αβ inputs
* α-β Power Calculation
* eα
* eα
* eβ
* iα
* iβ
* 2026-06-27
.param K=1.5
* <Revision History>
* 2024-12-29: Initial version
* 2026-06-27: Added K scaling factor for LTspicePowerSim's amplitude-invariant Clarke/Park convention.
.ends pq_power

.subckt samplehold CLK IN OUT
R1 o 0 1k
B1 OUT 0 V=V(o)
* Sample & Hold
* binary
* 2025-3-23
.machine
.state LO 0
.state LATCH 1
.state HI 2
.rule LO LATCH V(clk)>.5
.rule LATCH HI  V(clk)>.9
.rule * LO V(clk)<.5
.output (o) IF((state==1),V(in),V(out))
.endmachine
.ends samplehold

.subckt saw clk saw
XX1 N002 N003 slope params: se={f} vsat=2
XX2 clk N004 posedge params: td={td}
XX3 N001 N004 N002 exor
XX4 N001 CONST K=1  ; pins K
XX5 N003 saw LIMIT max={vh} min=0  ; pins in out
* SAW Generator
* 2025-3-22
.param f=1Meg
.param td=10n
* frequency of the input clock
* delay from clk posedge to start of the slope
* 1
* 0
.param vh=1
* td
.ends saw

.subckt slope in out
I1 0 a {ibias}
C3 a 0 {cacc}
B1 out 0 V=IF(V(in)>0.5, se*(V(a)-V(b)), 0)
R1 o 0 1k
B2 b 0 V=V(o)
B3 N001 0 V=IF(V(in)>0.5,1, 0)
R2 N001 0 1k
.param se=1
* Slope
* binary
* dv/dt of the slope(V/sec)
* in
* out
* dv/dt=se
* 2026-03-18
* <Revision History>
* 2024-12-29: Initial Versoin
* 2025-02-23: Made following edit to remove negative spike at slope reset and improve simulation time.
*                     - scale of I1 & C2 by 1/1000, and reduced resistance of diode Ron and buffer Rout
*                     - changed C1 snubber parameter,
*                     - added D2 to clamp negative voltage at node a
*                     - added new parameter vsat to be able to specify saturating voltage
* 2025-04-12: Bug fix
*                     - Fixed a bug where the model would not work when vsat was set to a high voltage
*                     - Changed default vsat to 1000V (originally 1V).
* 2025-05-31: Solved convergence issue at high "se"
*                     - Replaced current source with state machine.
* 2026-01-02: Changed to .machine base for higher accuracy and convergence.
*                     - removed .param vsat
* 2026-03-18: Updated .machine statement syntax to support older version of the LTspice.
* .param vsat=1000 (removed)
.param cacc=1u
.param ibias=1u
.ic V(a)=0
.machine
.state LO 0
.state HI 1
.rule LO HI V(in)>.5
.rule HI LO V(in)<.5
.output (o) IF((state==1),V(b), V(a))
.endmachine
* dummy circuit to ensure stiff falling edge
.ends slope

.subckt posedge in out
A2 0 in 0 N001 0 0 out 0 AND
A1 in 0 0 0 0 N001 0 0 BUF TD={td}
.param td=10n
* Positive Edge Detector
* binary
* binary
* td
* pulse width
* 2024-12-29
.ends posedge

.subckt exor in1 in2 out
A1 0 in1 0 in2 0 0 out 0 XOR
* binary
* binary
* binary
* Exclusive OR
* 2024-12-29
.ends exor

.subckt phaseshift2 freq phase clk1 clk2
C1 a 0 0.5
V2 N001 0 2
B1 N001 a I=IF(V(b),0,V(freq))
B2 a 0 I=IF(V(b),V(freq),0)
R2 b 0 1k
B3 d 0 V=IF(V(phase)>180,180,V(phase))
A1 b 0 0 0 0 clk1 0 0 BUF
R1 c 0 1k
A3 c 0 0 0 0 0 clk2 0 BUF
B4 ph 0 V=IF(V(d)<-180,-180,V(d))/180+1n
.machine
.state LO 0
.state HI 1
.rule LO HI V(a)>(1+1n)
.rule HI LO V(a)<1n
.output (b) state
.endmachine
.ic V(a)=0
.machine
.state LO0a 0
.state LO0b 0
.state LO1a 0
.state LO1b 0
.state HI0a 1
.state HI0b 1
.state HI1a 1
.state HI1b 1
.rule LO0a LO1a V(ph)>=0
.rule LO1a LO0a V(ph)<0
.rule LO1a LO1b V(a)<1n
.rule LO1b HI1a V(a)>V(ph)
.rule HI1a HI1b V(a)>1+1n
.rule HI1b LO1a V(a)<(1-V(ph))
.rule LO0a LO0b V(a)>1+1n
.rule LO0b HI0a V(a)<abs(V(ph))
.rule HI0a HI0b V(a)<1n
.rule HI0b LO0a V(a)>(1-abs(V(ph)))
.output (c) state
.endmachine
.ic V(clk1)=0 V(clk2)=0
* Frequency Variable Phase Modulator
* Frequency(Hz)
* Phase(°)
* 2024-12-29
.ends phaseshift2

.subckt gain in out
B1 out 0 V={G}*V(in)
.param G=1
* GAIN
* 2024-12-29
.ends gain

.subckt lpf in out
R1 a N001 1k
C1 a 0 {Co}
B1 N001 0 V=V(in)
B2 v0 0 V=V(a)
B3 out 0 V=IF({n}==1,V(v0),V(v1))
R2 v1 0 1Gig
C2 v1 0 1
B5 0 v1 I=V(v2)
R3 v2 0 1Gig
C3 v2 0 1
B4 0 v2 I={-(2*pi*f)*(2*pi*f)*V(v1)-(2*pi*f/q)*V(v2)+(2*pi*f)*(2*pi*f)*V(in)}
* 1st/2nd order Low Pass Filter
* 2025-12-26
.param f=100k
.param n=1
.param q=0.5
.param Co=1/({f}*2k*PI)
* cut off frequency
* filter order (1:1st order, other: 2nd order)
* q factor (only for 2nd order)
* 1st Order LPF
* 2nd Order LPF
* <Revision History>
* 2025-03-23: Initial version
* 2025-12-26:
*  -  Replaced LTspice built in 2ndOrderLPF with discrete circuit to improve convergence.
*  -  Removed output MUX and replaced it with BV.
.ends lpf

* Three-Phase to Single-Phase HF Matrix Converter AC-DC with PQ-Based HML PWM
.tran 40m uic
* 2026.06.28
.options solver="norm"
.options method="gear"
K Lp Ls 1
* PQ_POWER
* Clarke
* Clarke
.param fsw=150k
.param Lf=1m
.param Lf_esr=100m
.param Cf=1u
.param Cf_esr=1
.param Lp=10m
.param Nps=sqrt(2)
.param Vout_nom=250
.param Vpri_cmd={Vout_nom/Nps}
* Quality Monitoring
* Clock
.lib MC_3PH_1PH_PQ_HML_PWM.lib
.backanno
.end